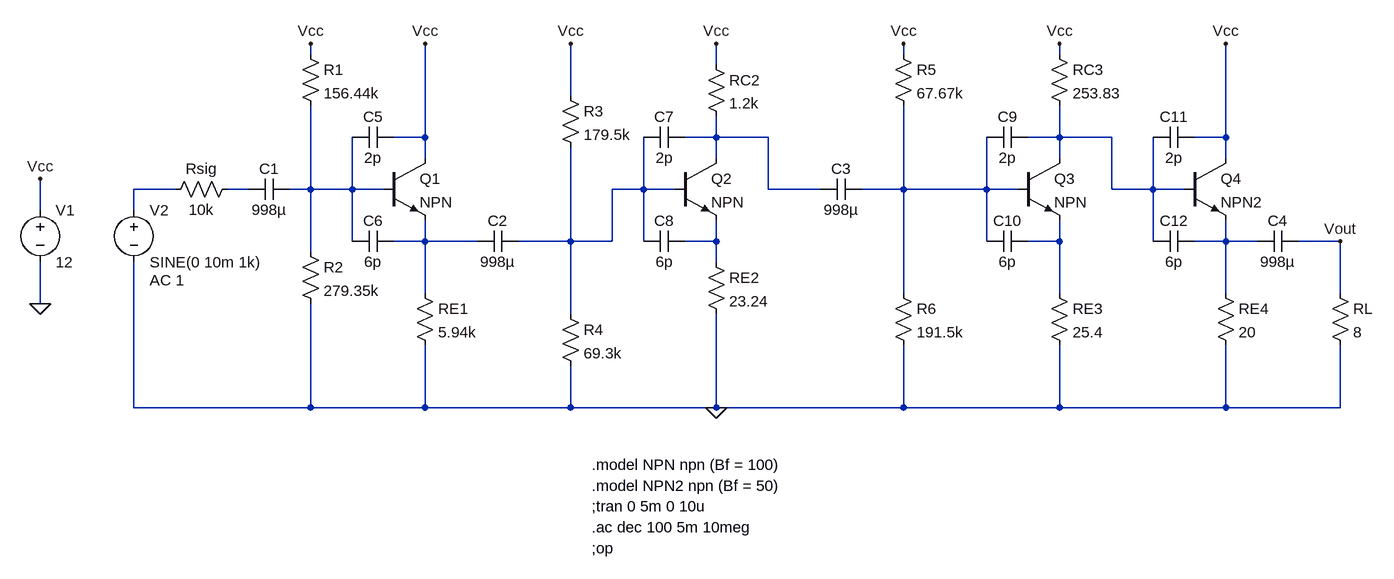
[diagram p0: schematic Final.asc]
Final.asc, the LTspice schematic file:
Version 4
SHEET 1 2308 696
WIRE 304 -80 304 -96
WIRE 1216 -80 1216 -96
WIRE 1456 -80 1456 -96
WIRE 928 -64 928 -96
WIRE 704 -16 704 -96
WIRE 480 48 480 -96
WIRE 480 48 432 48
WIRE 928 48 928 16
WIRE 928 48 880 48
WIRE 1008 48 928 48
WIRE 1456 48 1456 0
WIRE 1456 48 1408 48
WIRE 1536 48 1456 48
WIRE 1712 48 1712 -96
WIRE 1712 48 1664 48
WIRE 480 80 480 48
WIRE 928 80 928 48
WIRE 1456 80 1456 48
WIRE 1712 80 1712 48
WIRE 96 128 32 128
WIRE 208 128 176 128
WIRE 304 128 304 0
WIRE 304 128 272 128
WIRE 368 128 368 48
WIRE 368 128 304 128
WIRE 416 128 368 128
WIRE 816 128 816 48
WIRE 816 128 768 128
WIRE 864 128 816 128
WIRE 1008 128 1008 48
WIRE 1088 128 1008 128
WIRE 1216 128 1216 0
WIRE 1216 128 1152 128
WIRE 1344 128 1344 48
WIRE 1344 128 1216 128
WIRE 1392 128 1344 128
WIRE 1536 128 1536 48
WIRE 1600 128 1600 48
WIRE 1600 128 1536 128
WIRE 1648 128 1600 128
WIRE -112 160 -112 112
WIRE 32 160 32 128
WIRE 368 208 368 128
WIRE 480 208 480 176
WIRE 480 208 432 208
WIRE 560 208 480 208
WIRE 704 208 704 64
WIRE 704 208 624 208
WIRE 768 208 768 128
WIRE 768 208 704 208
WIRE 816 208 816 128
WIRE 928 208 928 176
WIRE 928 208 880 208
WIRE 1344 208 1344 128
WIRE 1456 208 1456 176
WIRE 1456 208 1408 208
WIRE 1600 208 1600 128
WIRE 1712 208 1712 176
WIRE 1712 208 1664 208
WIRE 1760 208 1712 208
WIRE 1888 208 1824 208
WIRE 304 224 304 128
WIRE 928 240 928 208
WIRE 480 288 480 208
WIRE 1216 288 1216 128
WIRE 1456 288 1456 208
WIRE 1712 288 1712 208
WIRE 1888 288 1888 208
WIRE -112 304 -112 240
WIRE 704 320 704 208
WIRE 32 464 32 240
WIRE 304 464 304 304
WIRE 304 464 32 464
WIRE 480 464 480 368
WIRE 480 464 304 464
WIRE 704 464 704 400
WIRE 704 464 480 464
WIRE 928 464 928 320
WIRE 928 464 704 464
WIRE 1216 464 1216 368
WIRE 1216 464 928 464
WIRE 1456 464 1456 368
WIRE 1456 464 1216 464
WIRE 1712 464 1712 368
WIRE 1712 464 1456 464
WIRE 1888 464 1888 368
WIRE 1888 464 1712 464
FLAG -112 304 0
FLAG -112 112 Vcc
FLAG 1888 208 Vout
FLAG 304 -96 Vcc
FLAG 480 -96 Vcc
FLAG 704 -96 Vcc
FLAG 1216 -96 Vcc
FLAG 1456 -96 Vcc
FLAG 928 464 0
FLAG 928 -96 Vcc
FLAG 1712 -96 Vcc
SYMBOL res 192 112 R90
WINDOW 0 0 56 VBottom 2
WINDOW 3 32 56 VTop 2
SYMATTR InstName Rsig
SYMATTR Value 10k
SYMBOL cap 272 112 R90
WINDOW 0 0 32 VBottom 2
WINDOW 3 32 32 VTop 2
SYMATTR InstName C1
SYMATTR Value 998µ
SYMBOL res 288 -96 R0
SYMATTR InstName R1
SYMATTR Value 156.44k
SYMBOL res 288 208 R0
SYMATTR InstName R2
SYMATTR Value 279.35k
SYMBOL npn 416 80 R0
SYMATTR InstName Q1
SYMBOL res 464 272 R0
SYMATTR InstName RE1
SYMATTR Value 5.94k
SYMBOL cap 624 192 R90
WINDOW 0 0 32 VBottom 2
WINDOW 3 32 32 VTop 2
SYMATTR InstName C2
SYMATTR Value 998µ
SYMBOL voltage -112 144 R0
WINDOW 123 0 0 Left 0
WINDOW 39 0 0 Left 0
SYMATTR InstName V1
SYMATTR Value 12
SYMBOL npn 864 80 R0
SYMATTR InstName Q2
SYMBOL res 688 -32 R0
SYMATTR InstName R3
SYMATTR Value 179.5k
SYMBOL res 688 304 R0
SYMATTR InstName R4
SYMATTR Value 69.3k
SYMBOL res 912 224 R0
SYMATTR InstName RE2
SYMATTR Value 23.24
SYMBOL res 912 -80 R0
SYMATTR InstName RC2
SYMATTR Value 1.2k
SYMBOL res 1200 -96 R0
SYMATTR InstName R5
SYMATTR Value 67.67k
SYMBOL res 1200 272 R0
SYMATTR InstName R6
SYMATTR Value 191.5k
SYMBOL npn 1392 80 R0
SYMATTR InstName Q3
SYMBOL res 1440 -96 R0
SYMATTR InstName RC3
SYMATTR Value 253.83
SYMBOL res 1440 272 R0
SYMATTR InstName RE3
SYMATTR Value 25.4
SYMBOL npn 1648 80 R0
SYMATTR InstName Q4
SYMATTR Value NPN2
SYMBOL res 1696 272 R0
SYMATTR InstName RE4
SYMATTR Value 20
SYMBOL res 1872 272 R0
SYMATTR InstName RL
SYMATTR Value 8
SYMBOL cap 1824 192 R90
WINDOW 0 0 32 VBottom 2
WINDOW 3 32 32 VTop 2
SYMATTR InstName C4
SYMATTR Value 998µ
SYMBOL cap 432 32 R90
WINDOW 0 0 32 VBottom 2
WINDOW 3 32 32 VTop 2
SYMATTR InstName C5
SYMATTR Value 2p
SYMBOL cap 432 192 R90
WINDOW 0 0 32 VBottom 2
WINDOW 3 32 32 VTop 2
SYMATTR InstName C6
SYMATTR Value 6p
SYMBOL cap 880 32 R90
WINDOW 0 0 32 VBottom 2
WINDOW 3 32 32 VTop 2
SYMATTR InstName C7
SYMATTR Value 2p
SYMBOL cap 880 192 R90
WINDOW 0 0 32 VBottom 2
WINDOW 3 32 32 VTop 2
SYMATTR InstName C8
SYMATTR Value 6p
SYMBOL cap 1408 32 R90
WINDOW 0 0 32 VBottom 2
WINDOW 3 32 32 VTop 2
SYMATTR InstName C9
SYMATTR Value 2p
SYMBOL cap 1408 192 R90
WINDOW 0 0 32 VBottom 2
WINDOW 3 32 32 VTop 2
SYMATTR InstName C10
SYMATTR Value 6p
SYMBOL cap 1664 32 R90
WINDOW 0 0 32 VBottom 2
WINDOW 3 32 32 VTop 2
SYMATTR InstName C11
SYMATTR Value 2p
SYMBOL cap 1664 192 R90
WINDOW 0 0 32 VBottom 2
WINDOW 3 32 32 VTop 2
SYMATTR InstName C12
SYMATTR Value 6p
SYMBOL cap 1152 112 R90
WINDOW 0 0 32 VBottom 2
WINDOW 3 32 32 VTop 2
SYMATTR InstName C3
SYMATTR Value 998µ
SYMBOL voltage 32 144 R0
WINDOW 123 24 124 Left 2
WINDOW 39 0 0 Left 0
SYMATTR Value2 AC 1
SYMATTR InstName V2
SYMATTR Value SINE(0 10m 1k)
TEXT 736 552 Left 2 !.model NPN npn (Bf = 100)
TEXT 736 584 Left 2 !.model NPN2 npn (Bf = 50)
TEXT 736 616 Left 2 !;tran 0 5m 0 10u
TEXT 736 648 Left 2 !.ac dec 100 5m 10meg
TEXT 736 680 Left 2 !;op

The netlist it stands for:
* Final.asc
Rsig N004 N003 10k
C1 N005 N004 998µ
R1 Vcc N005 156.44k
R2 N005 0 279.35k
Q1 Vcc N005 N008 0 NPN
RE1 N008 0 5.94k
C2 N006 N008 998µ
V1 Vcc 0 12
Q2 N001 N006 N009 0 NPN
R3 Vcc N006 179.5k
R4 N006 0 69.3k
RE2 N009 0 23.24
RC2 Vcc N001 1.2k
R5 Vcc N007 67.67k
R6 N007 0 191.5k
Q3 N002 N007 N010 0 NPN
RC3 Vcc N002 253.83
RE3 N010 0 25.4
Q4 Vcc N002 N011 0 NPN2
RE4 N011 0 20
RL Vout 0 8
C4 Vout N011 998µ
C5 Vcc N005 2p
C6 N008 N005 6p
C7 N001 N006 2p
C8 N009 N006 6p
C9 N002 N007 2p
C10 N010 N007 6p
C11 Vcc N002 2p
C12 N011 N002 6p
C3 N007 N001 998µ
V2 N003 0 SINE(0 10m 1k) AC 1
.model NPN NPN
.model PNP PNP
.lib standard.bjt
.model NPN npn (Bf = 100)
.model NPN2 npn (Bf = 50)
;tran 0 5m 0 10u
.ac dec 100 5m 10meg
;op
.backanno
.end